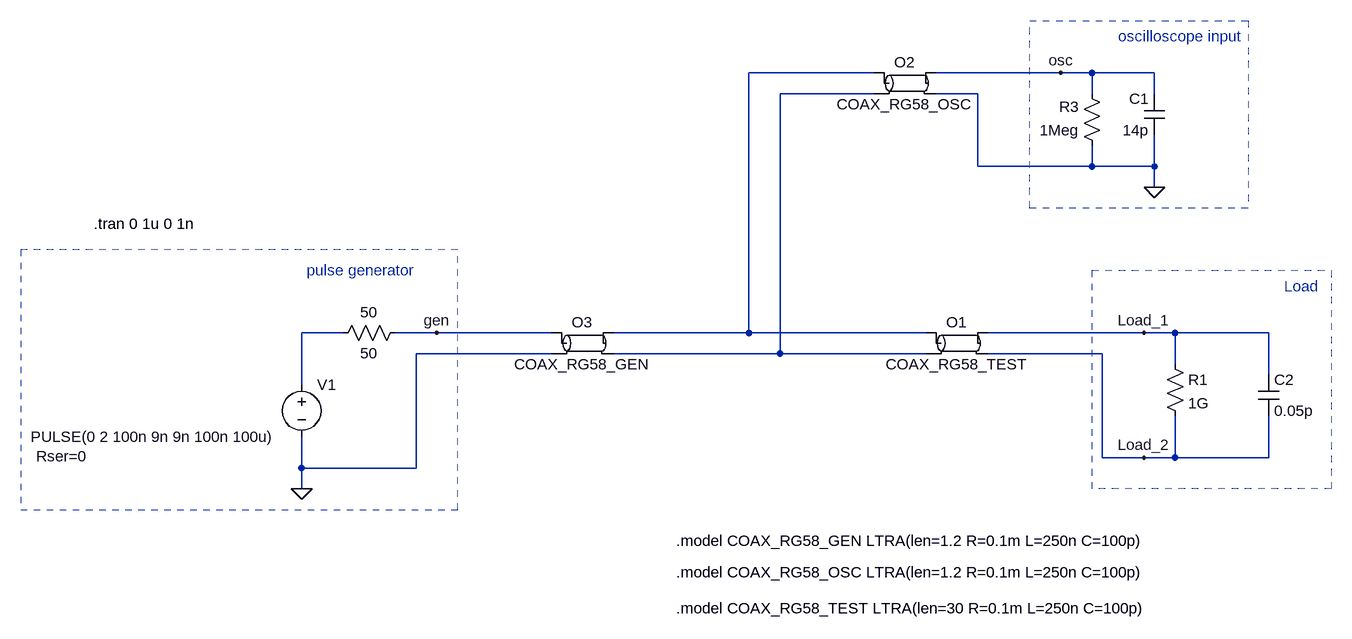
[diagram p0: schematic coaxial_cable_oscilloscope_input.asc]
coaxial_cable_oscilloscope_input.asc, the LTspice schematic file:
Version 4
SHEET 1 1332 680
WIRE 128 -272 -64 -272
WIRE 416 -272 224 -272
WIRE 464 -272 416 -272
WIRE 560 -272 464 -272
WIRE 128 -240 -16 -240
WIRE 288 -240 224 -240
WIRE 464 -240 464 -272
WIRE 560 -240 560 -272
WIRE 288 -128 288 -240
WIRE 464 -128 464 -160
WIRE 464 -128 288 -128
WIRE 560 -128 560 -176
WIRE 560 -128 464 -128
WIRE 560 -96 560 -128
WIRE -688 128 -752 128
WIRE -544 128 -608 128
WIRE -368 128 -544 128
WIRE -64 128 -64 -272
WIRE -64 128 -272 128
WIRE 208 128 -64 128
WIRE 544 128 304 128
WIRE 592 128 544 128
WIRE 736 128 592 128
WIRE -368 160 -576 160
WIRE -16 160 -16 -240
WIRE -16 160 -272 160
WIRE 208 160 -16 160
WIRE 480 160 304 160
WIRE 592 176 592 128
WIRE 736 192 736 128
WIRE -752 208 -752 128
WIRE 480 320 480 160
WIRE 544 320 480 320
WIRE 592 320 592 256
WIRE 592 320 544 320
WIRE 736 320 736 256
WIRE 736 320 592 320
WIRE -752 336 -752 288
WIRE -576 336 -576 160
WIRE -576 336 -752 336
WIRE -752 368 -752 336
FLAG -752 368 0
FLAG 544 128 Load_1
FLAG 544 320 Load_2
FLAG 560 -96 0
FLAG 416 -272 osc
FLAG -544 128 gen
SYMBOL res 576 160 R0
SYMATTR InstName R1
SYMATTR Value 1G
SYMBOL voltage -752 192 R0
WINDOW 3 -417 96 Left 2
WINDOW 123 0 0 Left 0
WINDOW 39 -408 126 Left 2
SYMATTR Value PULSE(0 2 100n 9n 9n 100n 100u)
SYMATTR SpiceLine Rser=0
SYMATTR InstName V1
SYMBOL ltline 256 144 R0
SYMATTR InstName O1
SYMATTR Value COAX_RG58_TEST
SYMBOL res -592 112 R90
WINDOW 0 0 56 VBottom 2
WINDOW 3 32 56 VTop 2
SYMATTR InstName 50
SYMATTR Value 50
SYMBOL ltline 176 -256 R0
SYMATTR InstName O2
SYMATTR Value COAX_RG58_OSC
SYMBOL res 480 -144 R180
WINDOW 0 36 76 Left 2
WINDOW 3 36 40 Left 2
SYMATTR InstName R3
SYMATTR Value 1Meg
SYMBOL cap 576 -176 R180
WINDOW 0 24 56 Left 2
WINDOW 3 24 8 Left 2
SYMATTR InstName C1
SYMATTR Value 14p
SYMBOL cap 720 192 R0
SYMATTR InstName C2
SYMATTR Value 0.05p
SYMBOL ltline -320 144 R0
SYMATTR InstName O3
SYMATTR Value COAX_RG58_GEN
TEXT -176 496 Left 2 !.model COAX_RG58_OSC LTRA(len=1.2 R=0.1m L=250n C=100p)
TEXT -1072 -40 Left 2 !.tran 0 1u 0 1n
TEXT -176 552 Left 2 !.model COAX_RG58_TEST LTRA(len=30 R=0.1m L=250n C=100p)
TEXT -176 448 Left 2 !.model COAX_RG58_GEN LTRA(len=1.2 R=0.1m L=250n C=100p)
TEXT 760 56 Left 2 ;Load
TEXT 504 -328 Left 2 ;oscilloscope input
TEXT -744 32 Left 2 ;pulse generator
RECTANGLE Normal 832 368 464 32 2
RECTANGLE Normal 704 -64 368 -352 2
RECTANGLE Normal -1184 400 -512 0 2

The netlist it stands for:
* coaxial_cable_oscilloscope_input.asc
R1 Load_1 Load_2 1G
V1 N003 0 PULSE(0 2 100n 9n 9n 100n 100u) Rser=0
O1 N001 N002 Load_1 Load_2 COAX_RG58_TEST
R§50 gen N003 50
O2 N001 N002 osc 0 COAX_RG58_OSC
R3 0 osc 1Meg
C1 0 osc 14p
C2 Load_1 Load_2 0.05p
O3 gen 0 N001 N002 COAX_RG58_GEN
.model COAX_RG58_OSC LTRA(len=1.2 R=0.1m L=250n C=100p)
.tran 0 1u 0 1n
.model COAX_RG58_TEST LTRA(len=30 R=0.1m L=250n C=100p)
.model COAX_RG58_GEN LTRA(len=1.2 R=0.1m L=250n C=100p)
* Load
* oscilloscope input
* pulse generator
.backanno
.end